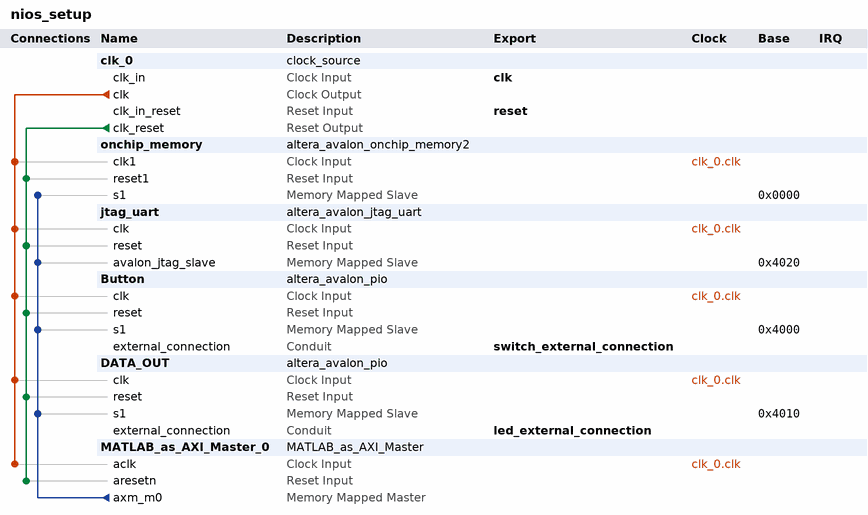
[diagram p0: system contents]
# Platform Designer (Qsys) system nios_setup, Cyclone 10 LP 10CL025YU256I7G
# Parameters at their usual value, and those the tool derives, are not listed.
package require -exact qsys 18.1
create_system nios_setup
set_project_property DEVICE_FAMILY {Cyclone 10 LP}
set_project_property DEVICE 10CL025YU256I7G

add_instance clk_0 clock_source 18.1
set_instance_parameter_value clk_0 clockFrequency 50000000

add_instance onchip_memory altera_avalon_onchip_memory2 18.1
set_instance_parameter_value onchip_memory dataWidth 32
set_instance_parameter_value onchip_memory dualPort false
set_instance_parameter_value onchip_memory initMemContent true
set_instance_parameter_value onchip_memory initializationFileName onchip_mem.hex
set_instance_parameter_value onchip_memory memorySize 16384
set_instance_parameter_value onchip_memory singleClockOperation true

add_instance jtag_uart altera_avalon_jtag_uart 18.1
set_instance_parameter_value jtag_uart simInteractiveOptions NO_INTERACTIVE_WINDOWS

add_instance Button altera_avalon_pio 18.1
set_instance_parameter_value Button direction Output
set_instance_parameter_value Button width 3

add_instance DATA_OUT altera_avalon_pio 18.1
set_instance_parameter_value DATA_OUT direction Input
set_instance_parameter_value DATA_OUT width 5

add_instance MATLAB_as_AXI_Master_0 MATLAB_as_AXI_Master 1.1
set_instance_parameter_value MATLAB_as_AXI_Master_0 AXI_ADDR_WIDTH 32
set_instance_parameter_value MATLAB_as_AXI_Master_0 AXI_DATA_WIDTH 64
set_instance_parameter_value MATLAB_as_AXI_Master_0 ID_WIDTH 1
set_instance_parameter_value MATLAB_as_AXI_Master_0 JTAG_ID 56

# connections
add_connection clk_0.clk Button.clk clock
add_connection clk_0.clk DATA_OUT.clk clock
add_connection clk_0.clk jtag_uart.clk clock
add_connection clk_0.clk MATLAB_as_AXI_Master_0.aclk clock
add_connection clk_0.clk onchip_memory.clk1 clock
add_connection clk_0.clk_reset Button.reset reset
add_connection clk_0.clk_reset DATA_OUT.reset reset
add_connection clk_0.clk_reset jtag_uart.reset reset
add_connection clk_0.clk_reset MATLAB_as_AXI_Master_0.aresetn reset
add_connection clk_0.clk_reset onchip_memory.reset1 reset
add_connection MATLAB_as_AXI_Master_0.axm_m0 Button.s1 avalon
set_connection_parameter_value MATLAB_as_AXI_Master_0.axm_m0/Button.s1 baseAddress 0x4000
add_connection MATLAB_as_AXI_Master_0.axm_m0 DATA_OUT.s1 avalon
set_connection_parameter_value MATLAB_as_AXI_Master_0.axm_m0/DATA_OUT.s1 baseAddress 0x4010
add_connection MATLAB_as_AXI_Master_0.axm_m0 jtag_uart.avalon_jtag_slave avalon
set_connection_parameter_value MATLAB_as_AXI_Master_0.axm_m0/jtag_uart.avalon_jtag_slave baseAddress 0x4020
add_connection MATLAB_as_AXI_Master_0.axm_m0 onchip_memory.s1 avalon
set_connection_parameter_value MATLAB_as_AXI_Master_0.axm_m0/onchip_memory.s1 baseAddress 0x0000

# exported interfaces
add_interface clk clock sink
set_interface_property clk EXPORT_OF clk_0.clk_in
add_interface led_external_connection conduit end
set_interface_property led_external_connection EXPORT_OF DATA_OUT.external_connection
add_interface reset reset sink
set_interface_property reset EXPORT_OF clk_0.clk_in_reset
add_interface switch_external_connection conduit end
set_interface_property switch_external_connection EXPORT_OF Button.external_connection

set_interconnect_requirement {$system} qsys_mm.clockCrossingAdapter HANDSHAKE
set_interconnect_requirement {$system} qsys_mm.enableEccProtection FALSE
set_interconnect_requirement {$system} qsys_mm.insertDefaultSlave FALSE
set_interconnect_requirement {$system} qsys_mm.maxAdditionalLatency 1

save_system nios_setup.qsys
